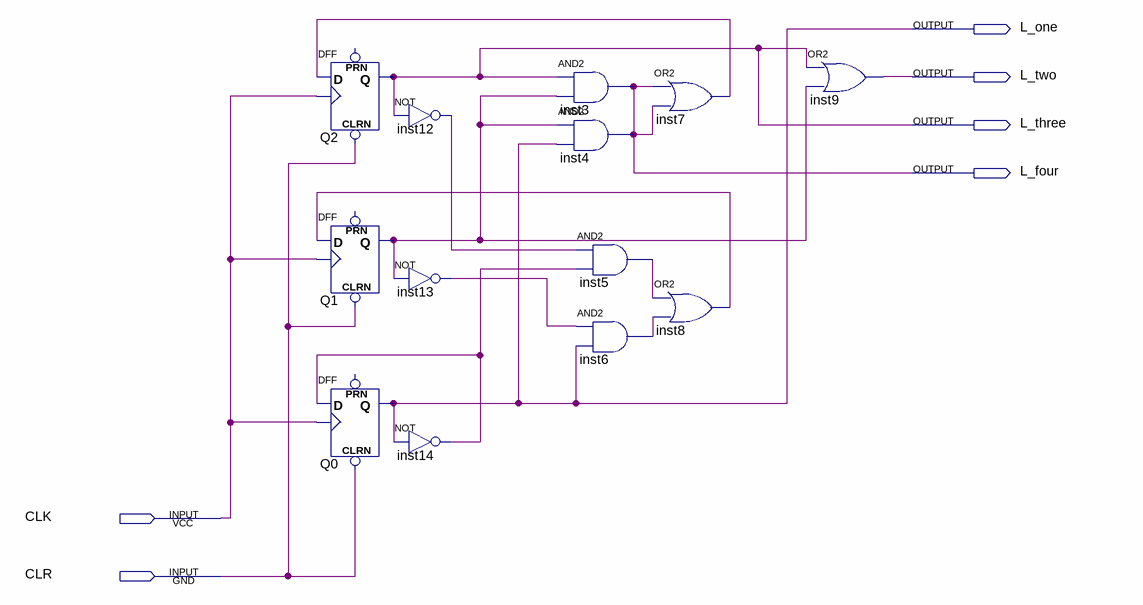
[diagram p0: schematic sheet]
// Quartus schematic dice.bdf as structural Verilog: 13 symbols, 6 pins
module dice (
  input  CLK,
  input  CLR,
  output L_one,
  output L_two,
  output L_three,
  output L_four
);

  wire inst5_out, inst6_out, inst7_out, inst8_out, inst12_out, inst13_out, inst14_out, Q1_q;

  DFF Q2 (.CLRN(CLR), .CLK(CLK), .D(inst7_out), .Q(L_three));  // open: PRN
  DFF Q1 (.CLRN(CLR), .CLK(CLK), .D(inst8_out), .Q(Q1_q));  // open: PRN
  DFF Q0 (.CLRN(CLR), .CLK(CLK), .D(inst14_out), .Q(L_one));  // open: PRN
  not inst12 (inst12_out, L_three);
  not inst13 (inst13_out, Q1_q);
  not inst14 (inst14_out, L_one);
  and inst3 (L_four, L_three, Q1_q);
  and inst4 (L_four, Q1_q, L_one);
  and inst5 (inst5_out, inst12_out, inst14_out);
  and inst6 (inst6_out, inst13_out, L_one);
  or inst7 (inst7_out, L_four, L_four);
  or inst8 (inst8_out, inst5_out, inst6_out);
  or inst9 (L_two, L_three, Q1_q);
endmodule
